# Altium project AMA4B_adapter_board.PrjPcb (part 2 of 2)

## Sheet P02_AMOLED.SchDoc
size A4; SheetNumber: 2; SheetTotal: 7
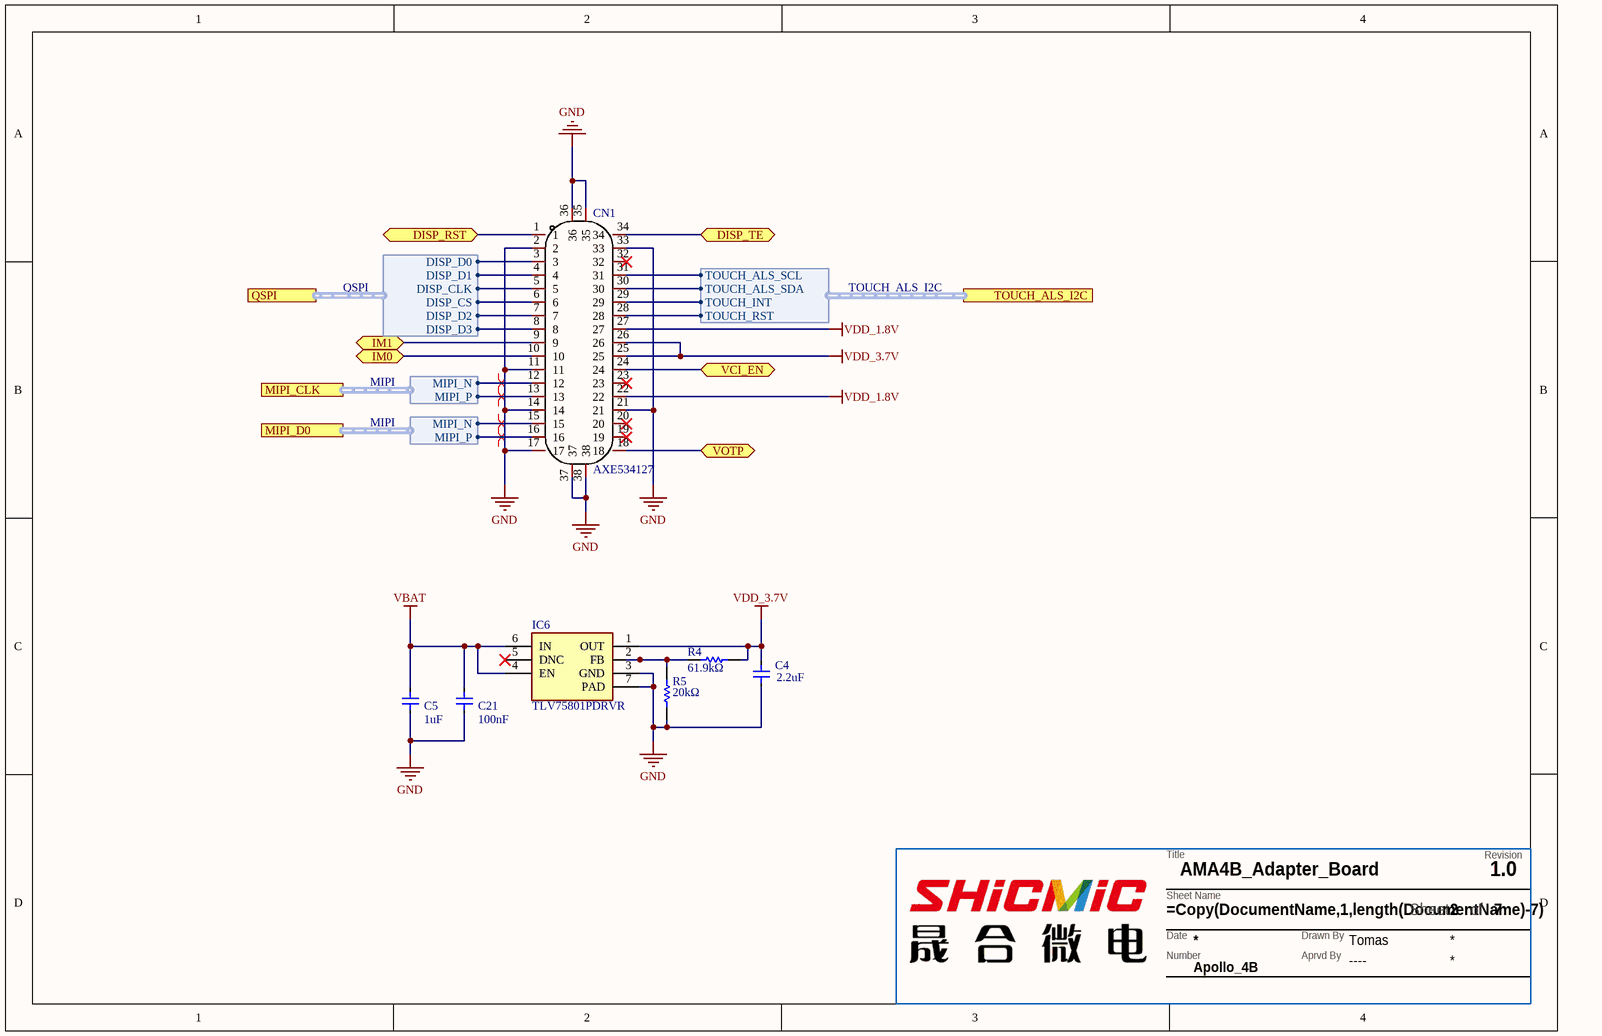
[diagram p6: P02_AMOLED.SchDoc]

### Parts
(Parts that share a designator on the sheet are numbered #1, #2 ... from top to bottom, then left to right.)
??#2  TitleBlock  (value not drawn)  (graphical)
C4  2.2uF  [CAP_0402]
C5  1uF  [CAP_0402]
C21  100nF  [CAP_0402]
CN1  AXE534127  [CONN-SMD_34P-P0.40_AXE534127]
IC6  TLV75801PDRVR  [SON65P200X200X80-7N]
R4  61.9kΩ  [RES_0402]
R5  20kΩ  [RES_0402]

### Ports
DISP_RST (bidir), DISP_TE (bidir), IM0 (bidir), IM1 (bidir), MIPI_CLK (harness MIPI), MIPI_D0 (harness MIPI), QSPI (harness QSPI), TOUCH_ALS_I2C (harness TOUCH_ALS_I2C), VCI_EN (bidir), VOTP (bidir)

### Harnesses
MIPI: MIPI_N, MIPI_P
QSPI: DISP_CLK, DISP_CS, DISP_D0, DISP_D1, DISP_D2, DISP_D3
TOUCH_ALS_I2C: TOUCH_ALS_SCL, TOUCH_ALS_SDA, TOUCH_INT, TOUCH_RST

### Nets
GND: C4.2 C5.2 C21.2 CN1.2 CN1.11 CN1.14 CN1.17 CN1.21 CN1.33 CN1.35 CN1.36 CN1.37 CN1.38 IC6.3(GND) IC6.7(PAD) R5.2
VBAT: C5.1 C21.1 IC6.4(EN) IC6.6(IN)
VDD_1.8V: CN1.22 CN1.27
VDD_3.7V: C4.1 CN1.25 CN1.26 IC6.1(OUT) R4.2
CTS01_GP59: CN1.9 ; port IM1
DISPCM_GP89: CN1.29 ; port TOUCH_ALS_I2C.TOUCH_INT
M0SCL_M0SCK_I2S0CK_RTS23_GP5: CN1.31 ; port TOUCH_ALS_I2C.TOUCH_ALS_SCL
M0SDA_M0MOSI_I2S0DAT_CTS01_I2S0DOUT_GP6: CN1.30 ; port TOUCH_ALS_I2C.TOUCH_ALS_SDA
M2MISO_DSPTCK_I2S0DIN_GP27: CN1.24 ; port VCI_EN
M2SDA_M2MOSI_DSPTCK_GP26: CN1.28 ; port TOUCH_ALS_I2C.TOUCH_RST
M3MISO_CKO_RX2_TE_GP33: CN1.34 ; port DISP_TE
MIPI_CLK.MIPI_N: CN1.12 ; port MIPI_CLK.MIPI_N
MIPI_CLK.MIPI_P: CN1.13 ; port MIPI_CLK.MIPI_P
MIPI_D0.MIPI_N: CN1.15 ; port MIPI_D0.MIPI_N
MIPI_D0.MIPI_P: CN1.16 ; port MIPI_D0.MIPI_P
MSPI00_32KXT_RTS0_DISPD0_I2S1DIN_GP64: CN1.3 ; port QSPI.DISP_D0
MSPI01_32KXT_CTS0_DISPD1_GP65: CN1.4 ; port QSPI.DISP_D1
MSPI02_CKO_TX0_DISPD2_GP66: CN1.7 ; port QSPI.DISP_D2
MSPI03_CKO_TX2_DISPD3_GP67: CN1.8 ; port QSPI.DISP_D3
MSPI08_CKO_SWTR2_TX0_DISPD8_GP72: CN1.5 ; port QSPI.DISP_CLK
PDM3DAT_SWO_RTS01_VCO_GP57: CN1.6 ; port QSPI.DISP_CS
RTS03_GP58: CN1.10 ; port IM0
TRIG0_VCO_I2S0DAT_CTS1_DSPTRSTN_I2S0DOUT_GP29: CN1.1 ; port DISP_RST
NetCN1_18: CN1.18 ; port VOTP
NetIC6_2: IC6.2(FB) R4.1 R5.1

Not connected (* = marked no-connect by the designer): CN1 19* 20* 23* 32*; IC6 5(DNC)*

### Layout directives
differential pair: MIPI_CLK.MIPI_N, MIPI_CLK.MIPI_P, MIPI_D0.MIPI_N, MIPI_D0.MIPI_P

### Notes on the sheet
- (in symbol TitleBlock) Revision; Title; Sheet Name; Sheet; of; Date; Drawn By; Number; Aprvd By

### Library data of the parts
??#2 = TitleBlock: Title block for Ambiq Schematics. Please have the following parameters entered in Project>Project Options>Parameters: / TBTitle / TBDocumentNumber / TBRevision / TBDrawnBy / TBApprovedBy; AMBIQ PN: TitleBlock
C4 = Capacitor: NONE; Manufacturer: Samsung; AMBIQ PN: CL05A225KP5NNNC; Tolerance: 10%; Voltage Rating: 10V; Supplier 1: Arrow Electronics; Supplier Part Number 1: CL05A225KP5NNNC; Manufacturer Part Number: CL05A225KP5NNNC; RoHS: Yes; Category: Ceramic Capacitors; Stock 1: 32414; Pricing 1: 1=0.14620, 10=0.09980, 25=0.09880, 100=0.05200, 250=0.05150, 500=0.03630, 1000=0.02990, 3000=0.02760, 6000=0.02610, 15000=0.023; Mount: Surface Mount; Case/Package: 0402; Case Code (Metric): 1005; Case Code (Imperial): 0402; Min Operating Temperature: -55°C; Max Operating Temperature: 85°C; Capacitance: 2.2uF; Packaging: Tape and Reel; Voltage Rating (DC): 10V; Series: CL; Length: 0.039inch; Width: 0.02inch; Thickness: 0.022inch; RoHS Compliant: Yes; ComponentLink1URL: https://datasheet.ciiva.com/25727/cl05a225kp5nnnc-25727777.pdf?src-supplier=Digi-Key; ComponentLink1Description: https://datasheet.ciiva.com/25727/cl05a225kp5nnnc-25727777.pdf?src-supplier=Digi-Key; Package Quantity: 1
C5 = Capacitor: NONE; Manufacturer: Samsung; Manufacturer Part Number: CL05A105MP5NNNC; AMBIQ PN: CL05A105KP5NNNC; Tolerance: 20%; Voltage Rating: 10V; Dielectric: X5R; Supplier 1: Newark; Supplier Part Number 1: 82AC9184; RoHS: Yes; Category: Ceramic Capacitors; Mount: Surface Mount; Case/Package: 0402; Case Code (Metric): 1005; Case Code (Imperial): 0402; Min Operating Temperature: -55°C; Max Operating Temperature: 85°C; Capacitance: 1uF; Packaging: Tape and Reel; Voltage Rating (DC): 10V; Series: CL; Construction: Flat; Length: 1mm; Width: 0.02inch; Height: 0.5mm; Thickness: 0.022inch; Depth: 0.5mm; Radiation Hardening: No; Lead Free: Lead Free; RoHS Compliant: Yes; ComponentLink1URL: https://datasheet.ciiva.com/25802/cl05a105mp5nnnc-25802049.pdf?src-supplier=Digi-Key; ComponentLink1Description: https://datasheet.ciiva.com/25802/cl05a105mp5nnnc-25802049.pdf?src-supplier=Digi-Key; Package Quantity: 1
C21 = Capacitor: NONE; Manufacturer: Kyocera AVX; AMBIQ PN: 0201ZD104KAT2A; Tolerance: 10%; Voltage Rating: 10V; Supplier 1: Arrow Electronics; Supplier Part Number 1: 0201ZD104KAT2A; Manufacturer Part Number: 0201ZD104KAT2A; RoHS: Yes; Category: Ceramic Capacitors; Stock 1: 105000; Pricing 1: 15000=0.00770, 30000=0.00750, 45000=0.00740, 60000=0.00720, 75000=0.00690, 150000=0.00620 (USD); Mount: Surface Mount; Case/Package: 0201; Case Code (Metric): 0603; Case Code (Imperial): 0201; Min Operating Temperature: -55°C; Max Operating Temperature: 85°C; Capacitance: 100nF; Packaging: Tape and Reel; Voltage Rating (DC): 10V; Series: -; Lead Free: Lead Free; RoHS Compliant: Yes; ComponentLink1URL: http://www.mouser.com/ds/2/40/cx5r-776519.pdf?src-supplier=Mouser; ComponentLink1Description: http://www.mouser.com/ds/2/40/cx5r-776519.pdf?src-supplier=Mouser
CN1 = AXE534127: Add into BOM: yes; Symbol: AXE534127; Device: AXE534127; LCSC Part Name: AXE534127; Supplier Part: C9900017244; Manufacturer Part: AXE534127; Supplier Footprint: SMD-34; JLCPCB Part Class: 扩展库; Datasheet: https://atta.szlcsc.comnull; Supplier: LCSC; Convert to PCB: yes; Name: AXE534127
IC6 = TLV75801PDRVR: Integrated Circuit; Manufacturer_Name: Texas Instruments; Datasheet Link: http://www.ti.com/lit/gpn/TLV758P; Height: 0.8mm; Manufacturer_Part_Number: TLV75801PDRVR; Mouser Part Number: 595-TLV75801PDRVR; Mouser Price/Stock: https://www.mouser.co.uk/ProductDetail/Texas-Instruments/TLV75801PDRVR?qs=PqoDHHvF64%2FZ6DyDKfEo8A%3D%3D; Arrow Part Number: TLV75801PDRVR; Arrow Price/Stock: https://www.arrow.com/en/products/tlv75801pdrvr/texas-instruments?region=europe
R4 = Resistor: Res Thick Film 0402 61.9K Ohm 1% 1/10W +/-100ppm/ßC Molded SMD Punched Carrier T/R; Manufacturer: Panasonic; AMBIQ PN: ERJ-2RKF6192X; Resistance: 61.9kR; Power Rating: 100mW; Voltage Rating: 50V; Temperature Coefficient: 100ppm/°C; Supplier 1: Arrow Electronics; Supplier Part Number 1: ERJ-2RKF6192X; Manufacturer Part Number: ERJ-2RKF6192X; RoHS: Yes; Category: Chip SMD Resistors; Stock 1: 50040; Pricing 1: 1=0.05180, 10=0.02920, 25=0.02020 (USD); Mount: Surface Mount; Case/Package: 0402; Case Code (Metric): 1005; Case Code (Imperial): 0402; Contact Plating: Tin; Min Operating Temperature: -55°C; Max Operating Temperature: 155°C; Package Quantity: 1; Packaging: Tape and Reel; Resistor Type: Thick Film; Number of Terminations: 2; Termination: SMD/SMT; Max Power Dissipation: 100mW; Voltage Rating (DC): 50V; Features: Automotive AEC-Q200; Series: ERJ; Construction: Rectangular; Length: 1mm; Width: 0.02inch; Height: 0.016inch; Depth: 0.5mm; REACH SVHC: No SVHC; Military Standard: Not; Lead Free: Lead Free; RoHS Compliant: Yes; ComponentLink1URL: https://datasheet.ciiva.com/31404/1678782-31404872.pdf?src-supplier=Farnell; ComponentLink1Description: https://datasheet.ciiva.com/31404/1678782-31404872.pdf?src-supplier=Farnell; ComponentLink2URL: https://datasheet.ciiva.com/6201/426256-6201383.pdf?src-supplier=Farnell; ComponentLink2Description: https://datasheet.ciiva.com/6201/426256-6201383.pdf?src-supplier=Farnell; ComponentLink3URL: https://datasheet.ciiva.com/43460/426256-43460335.pdf?src-supplier=Farnell; Tolerance: 1%; Resistance Tolerance: 1%
R5 = Resistor: Res Thick Film 0402 20K Ohm 1% 1/16W ±100ppm/°C Molded SMD Paper T/R; Manufacturer: Vishay; AMBIQ PN: CRCW040220K0FKED; Resistance: 20kR; Power Rating: 63mW; Voltage Rating: 50V; Supplier 1: Newark; Supplier Part Number 1: 24W2083; Manufacturer Part Number: CRCW040220K0FKED; RoHS: Yes; Category: Chip SMD Resistors; Stock 1: 380000; Pricing 1: 1=0.00600, 10000=0.00600 (USD); Mount: Surface Mount; Case/Package: 0402; Weight: 2.3E-05oz; Case Code (Metric): 1005; Case Code (Imperial): 0402; Contact Plating: Tin; Min Operating Temperature: -55°C; Max Operating Temperature: 155°C; Package Quantity: 10; Packaging: Tape and Reel; Resistor Type: Thick Film; Number of Terminations: 2; Termination: SMD/SMT; Max Power Dissipation: 63mW; Temperature Coefficient: 100ppm/°C; Voltage Rating (DC): 50V; Features: Automotive AEC-Q200; Series: CRCW; Technology: THICK FILM; Construction: Rectangular; Length: 1mm; Width: 0.5mm; Height: 0.35mm; Depth: 0.5mm; Radiation Hardening: No; REACH SVHC: Unknown; Military Standard: Not; Lead Free: Lead Free; RoHS Compliant: Yes; ComponentLink1URL: https://datasheet.ciiva.com/11810/0900766b80d98824-11810023.pdf?src-supplier=RSComponents; ComponentLink1Description: https://datasheet.ciiva.com/11810/0900766b80d98824-11810023.pdf?src-supplier=RSComponents; ComponentLink2URL: https://datasheet.ciiva.com/2463/dcrcwe3-2463139.pdf?src-supplier=Digi-Key; ComponentLink2Description: https://datasheet.ciiva.com/2463/dcrcwe3-2463139.pdf?src-supplier=Digi-Key; ComponentLink3URL: https://datasheet.ciiva.com/2463/dcrcwe3-2463140.pdf?src-supplier=Digi-Key; Tolerance: 1%; Number of Pins: 2; Resistance Tolerance: 1%; Working Voltage: 50V

## Sheet P07_Peripheral.SchDoc
size A4; SheetNumber: 7; SheetTotal: 7
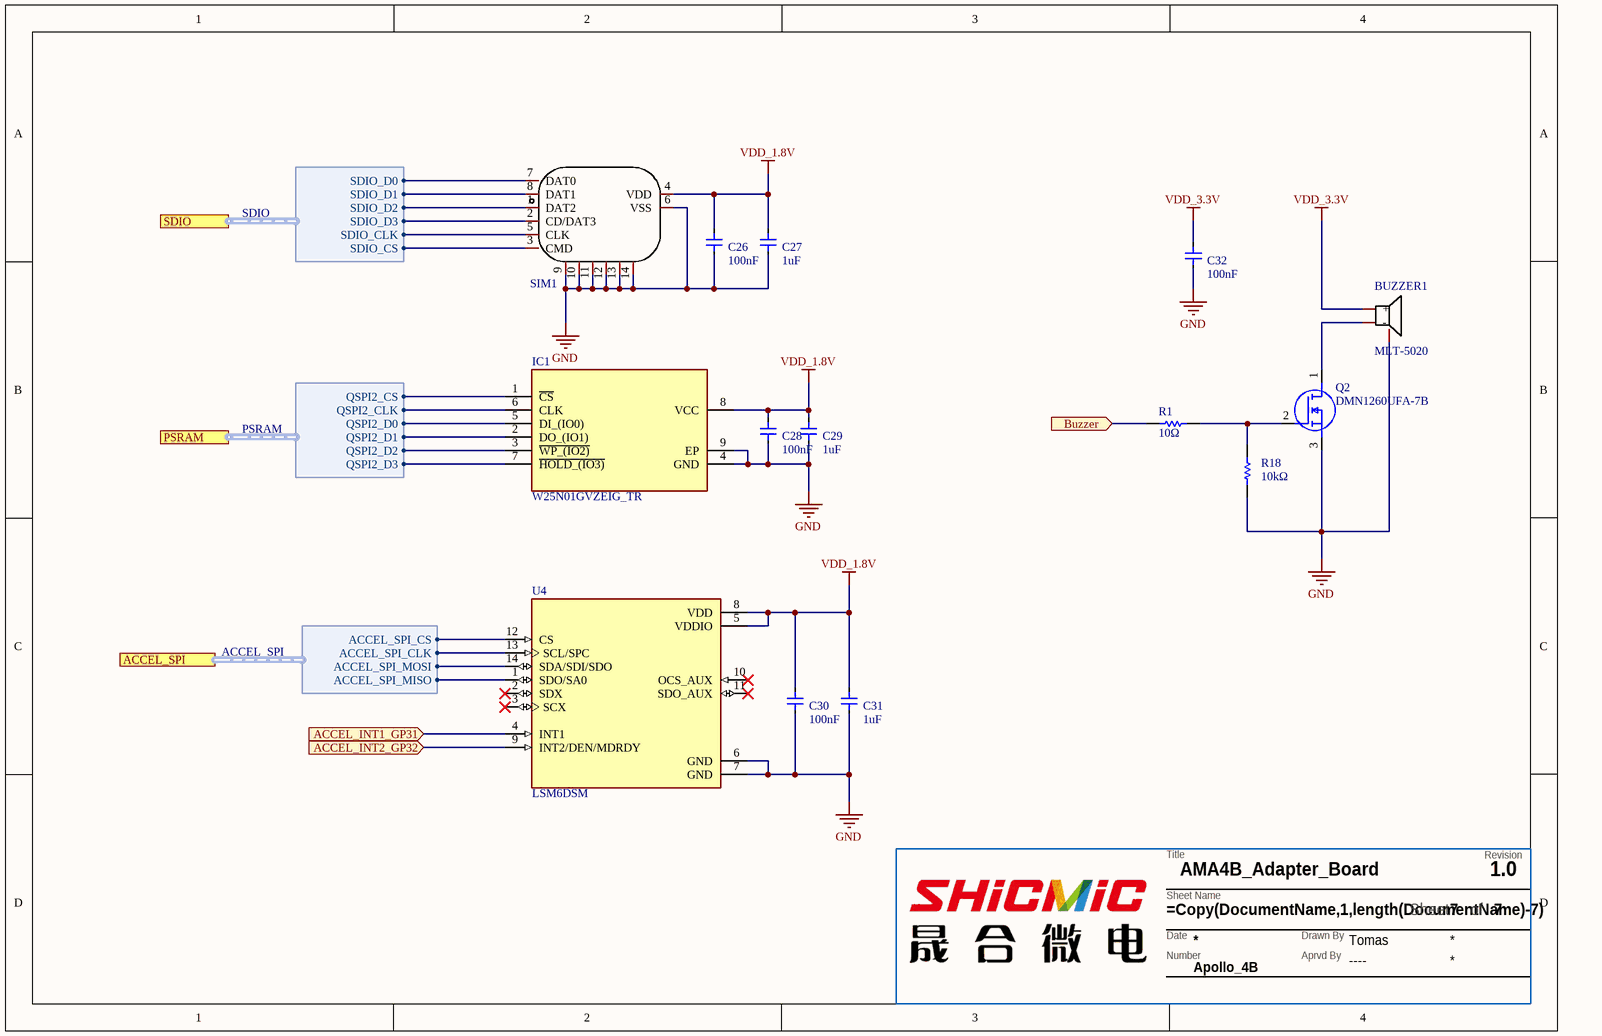
[diagram p7: P07_Peripheral.SchDoc]

### Parts
(Parts that share a designator on the sheet are numbered #1, #2 ... from top to bottom, then left to right.)
??#3  TitleBlock  (value not drawn)  (graphical)
BUZZER1  4000Hz  [BUZ-SMD_L5.0-W5.5-P4.60]  (value not drawn)
C26  100nF  [CAP_0402]
C27  1uF  [CAP_0402]
C28  100nF  [CAP_0402]
C29  1uF  [CAP_0402]
C30  100nF  [CAP_0402]
C31  1uF  [CAP_0402]
C32  100nF  [CAP_0402]
IC1  W25N01GVZEIG_TR  [SON127P800X600X80-9N-D]
Q2  DMN1260UFA-7B  [DMN1260UFA7B]
R1  10Ω  [RES_0402]
R18  10kΩ  [RES_0402]
SIM1  1040310811  [SIM-SMD_8P-1040310811]  (value not drawn)
U4  LSM6DSM  [PQFN50P300X250X86-14N]

### Ports
ACCEL_INT1_GP31 (in), ACCEL_INT2_GP32 (in), ACCEL_SPI (harness ACCEL_SPI), Buzzer (in), PSRAM (harness PSRAM), SDIO (harness SDIO)

### Harnesses
ACCEL_SPI: ACCEL_SPI_CLK, ACCEL_SPI_CS, ACCEL_SPI_MISO, ACCEL_SPI_MOSI
PSRAM: QSPI2_CLK, QSPI2_CS, QSPI2_D0, QSPI2_D1, QSPI2_D2, QSPI2_D3
SDIO: SDIO_CLK, SDIO_CS, SDIO_D0, SDIO_D1, SDIO_D2, SDIO_D3

### Nets
GND: BUZZER1.3(NC) C26.2 C27.2 C28.2 C29.2 C30.2 C31.2 C32.2 IC1.4(GND) IC1.9(EP) Q2.3(S) R18.1 SIM1.6(VSS) SIM1.9 SIM1.10 SIM1.11 SIM1.12 SIM1.13 SIM1.14 U4.6(GND) U4.7(GND)
VDD_1.8V: C26.1 C27.1 C28.1 C29.1 C30.1 C31.1 IC1.8(VCC) SIM1.4(VDD) U4.5(VDDIO) U4.8(VDD)
VDD_3.3V: BUZZER1.1(+) C32.1
CMIN1_I2S0CK_RX23_GP11: U4.12(CS) ; port ACCEL_SPI.ACCEL_SPI_CS
M2SCL_M2SCK_DSPTMS_GP25: IC1.1(~{CS}) ; port PSRAM.QSPI2_CS
M3SCL_M3SCK_TX2_GP31: U4.4(INT1) ; port ACCEL_INT1_GP31
M3SDA_M3MOSI_RX0_GP32: U4.9(INT2/DEN/MDRDY) ; port ACCEL_INT2_GP32
M7MISO_SWO_RTS01_GP24: U4.1(SDO/SA0) ; port ACCEL_SPI.ACCEL_SPI_MISO
M7SCL_M7SCK_SWO_RX01_GP22: U4.13(SCL/SPC) ; port ACCEL_SPI.ACCEL_SPI_CLK
M7SDA_M7MOSI_SWO_RX23_GP23: U4.14(SDA/SDI/SDO) ; port ACCEL_SPI.ACCEL_SPI_MOSI
MSPI20_QSPID0_RX0_DISPD10_DSPISD_GP74: IC1.5(DI_(IO0)) ; port PSRAM.QSPI2_D0
MSPI21_QSPID1_RX2_DISPD11_DSPIDCX_GP75: IC1.2(DO_(IO1)) ; port PSRAM.QSPI2_D1
MSPI22_QSPID2_RTS0_DISPD12_GP76: IC1.3(~{WP_(IO2)}) ; port PSRAM.QSPI2_D2
MSPI23_QSPID3_CTS0_DISPD13_GP77: IC1.7(~{HOLD_(IO3)}) ; port PSRAM.QSPI2_D3
MSPI24_QSPISCK_DISPD14_DSPISCK_GP78: IC1.6(CLK) ; port PSRAM.QSPI2_CLK
MSPI29_32KXT_SDIFCMD_SWTR3_DISPSD_GP83: SIM1.3(CMD) ; port SDIO.SDIO_CS
SDIFCK0_GP88: SIM1.5(CLK) ; port SDIO.SDIO_CLK
SDIFD0_GP84: SIM1.7(DAT0) ; port SDIO.SDIO_D0
SDIFD1_GP85: SIM1.8(DAT1) ; port SDIO.SDIO_D1
SDIFD2_GP86: SIM1.1(DAT2) ; port SDIO.SDIO_D2
SDIFD3_TE_GP87: SIM1.2(CD/DAT3) ; port SDIO.SDIO_D3
VCO_GP90: R1.2 ; port Buzzer
NetBUZZER1_2: BUZZER1.2(-) Q2.1(D)
NetQ2_2: Q2.2(G) R1.1 R18.2

Not connected (* = marked no-connect by the designer): U4 2(SDX)* 3(SCX)* 10(OCS_AUX)* 11(SDO_AUX)*

### Notes on the sheet
- (in symbol TitleBlock) Revision; Title; Sheet Name; Sheet; of; Date; Drawn By; Number; Aprvd By

### Library data of the parts
??#3 = TitleBlock: as ??#2 on sheet P02_AMOLED; AMBIQ PN: TitleBlock
BUZZER1 = MLT-5020: Manufacturer: 华能; Add into BOM: yes; Oscillator Circuit: 无源(外部驱动); Technology Type: 电磁式; Name: 4000Hz; Symbol: MLT-5020; LCSC Part Name: MLT-5020; Supplier Part: C94598; Manufacturer Part: MLT-5020; Supplier Footprint: SMD,5x5mm; JLCPCB Part Class: 扩展库; Datasheet: https://atta.szlcsc.com/upload/public/pdf/source/20210811/111454390007D221D7259018FB170E62.pdf; Supplier: LCSC; Convert to PCB: yes; Value: 4000Hz; Length: 5.2mm; Width: 5.2mm; Height: 2.5mm; Device: MLT-5020
C26 C28 C30 C32 = Capacitor: as C21 on sheet P02_AMOLED; Supplier 1: Arrow Electronics; Supplier Part Number 1: 0201ZD104KAT2A; Manufacturer Part Number: 0201ZD104KAT2A; RoHS: Yes; Category: Ceramic Capacitors; Stock 1: 105000; Pricing 1: 15000=0.00770, 30000=0.00750, 45000=0.00740, 60000=0.00720, 75000=0.00690, 150000=0.00620 (USD); Mount: Surface Mount; Case/Package: 0201; Case Code (Metric): 0603; Case Code (Imperial): 0201; Min Operating Temperature: -55°C; Max Operating Temperature: 85°C; Capacitance: 100nF; Packaging: Tape and Reel; Voltage Rating (DC): 10V; Series: -; Lead Free: Lead Free; RoHS Compliant: Yes; ComponentLink1URL: http://www.mouser.com/ds/2/40/cx5r-776519.pdf?src-supplier=Mouser; ComponentLink1Description: http://www.mouser.com/ds/2/40/cx5r-776519.pdf?src-supplier=Mouser
C27 C29 C31 = Capacitor: as C5 on sheet P02_AMOLED; Supplier 1: Newark; Supplier Part Number 1: 82AC9184; RoHS: Yes; Category: Ceramic Capacitors; Mount: Surface Mount; Case/Package: 0402; Case Code (Metric): 1005; Case Code (Imperial): 0402; Min Operating Temperature: -55°C; Max Operating Temperature: 85°C; Capacitance: 1uF; Packaging: Tape and Reel; Voltage Rating (DC): 10V; Series: CL; Construction: Flat; Length: 1mm; Width: 0.02inch; Height: 0.5mm; Thickness: 0.022inch; Depth: 0.5mm; Radiation Hardening: No; Lead Free: Lead Free; RoHS Compliant: Yes; ComponentLink1URL: https://datasheet.ciiva.com/25802/cl05a105mp5nnnc-25802049.pdf?src-supplier=Digi-Key; ComponentLink1Description: https://datasheet.ciiva.com/25802/cl05a105mp5nnnc-25802049.pdf?src-supplier=Digi-Key; Package Quantity: 1
IC1 = W25N01GVZEIG_TR: Integrated Circuit; Manufacturer_Name: Winbond; Manufacturer_Part_Number: W25N01GVZEIG TR; Datasheet Link: https://www.winbond.com/resource-files/w25n01gv revg 032116.pdf; Height: 0.8mm; Mouser Part Number: 454-W25N01GVZEIGTR; Mouser Price/Stock: https://www.mouser.co.uk/ProductDetail/Winbond/W25N01GVZEIG-TR?qs=qSfuJ%252Bfl%2Fd6niBi0Qz1MPg%3D%3D; Arrow Part Number: W25N01GVZEIG TR; Arrow Price/Stock: https://www.arrow.com/en/products/w25n01gvzeigtr/winbond-electronics?region=nac
Q2 = DMN1260UFA-7B: MOSFET (N-Channel); Manufacturer_Name: Diodes Incorporated; Datasheet Link: https://www.diodes.com/assets/Datasheets/DMN1260UFA.pdf; Height: 0.4mm; Manufacturer_Part_Number: DMN1260UFA-7B; Mouser Part Number: 621-DMN1260UFA-7B; Mouser Price/Stock: https://www.mouser.co.uk/ProductDetail/Diodes-Incorporated/DMN1260UFA-7B?qs=TL2rE588Q1GjQdkyrZCA4w%3D%3D; Arrow Part Number: DMN1260UFA-7B; Arrow Price/Stock: https://www.arrow.com/en/products/dmn1260ufa-7b/diodes-incorporated
R1 R18 = Resistor: Surface Mount Thick Film Resistor, Rc Series, 10 Kohm, 62.5 Mw, - 1%, 50 V, 0402 [1005 Metric]; Manufacturer: Yageo; AMBIQ PN: RC0402FR-0710KL; Resistance: 10kR; Power Rating: 62.5mW; Voltage Rating: 50V; Max Power Dissipation: 63mW; Temperature Coefficient: 100ppm/°C; Supplier 1: Arrow Electronics; Supplier Part Number 1: RC0402FR-0710KL; Manufacturer Part Number: RC0402FR-0710KL; RoHS: Yes; Category: Chip SMD Resistors; Stock 1: 7776428; Pricing 1: 10000=0.00210 (USD); Case/Package: 0402; Case Code (Metric): 1005; Case Code (Imperial): 0402; Min Operating Temperature: -55°C; Max Operating Temperature: 155°C; Packaging: Tape and Reel; Resistor Type: Thick Film; Number of Terminations: 2; Termination: SMD/SMT; Voltage Rating (DC): 50V; Features: Moisture Resistant; Series: RC; Construction: Rectangular; Length: 1mm; Width: 0.5mm; Height: 0.32mm; Depth: 0.5mm; REACH SVHC: No SVHC; Military Standard: Not; Lead Free: Lead Free; RoHS Compliant: Yes; ComponentLink1URL: https://datasheet.ciiva.com/7660/38568-7660787.pdf?src-supplier=Element14; ComponentLink1Description: https://datasheet.ciiva.com/7660/38568-7660787.pdf?src-supplier=Element14; ComponentLink2URL: https://datasheet.ciiva.com/7849/1686128-7849814.pdf?src-supplier=Element14; ComponentLink2Description: https://datasheet.ciiva.com/7849/1686128-7849814.pdf?src-supplier=Element14; ComponentLink3URL: https://datasheet.ciiva.com/7983/1018594-7983486.pdf?src-supplier=Element14; Tolerance: 1%; Number of Pins: 2; Resistance Tolerance: 1%; Working Voltage: 50V; Lead Pitch: 0.2mm
SIM1 = 1040310811: Manufacturer: MOLEX; Add into BOM: yes; Card Connection Mode: 拔插式; Card Type: MicroSD卡(TF卡); Connector Type: 卡座; Maximum Body Height: 1.42mm; Name: 1040310811; Symbol: 1040310811; Device: 1040310811; LCSC Part Name: 拔插式 MicroSD卡(TF卡) 卡座; Supplier Part: C585350; Manufacturer Part: 1040310811; Supplier Footprint: SMD; JLCPCB Part Class: 扩展库; Datasheet: https://atta.szlcsc.com/upload/public/pdf/source/20201117/C585350_D1F0B30BD23514449186B2E50ACE8BBF.pdf; Supplier: LCSC; Convert to PCB: yes; Operating Temperature Range: -
U4 = LSM6DSM: Accelerometer, Gyroscope, Temperature, 6 Axis Sensor IÂ²C, SPI Output; MF: STMicroelectronics; Availability: In Stock; Purchase-URL: https://pricing.snapeda.com/search/part/LSM6DSM/?ref=eda; Package: VFLGA-14 STMicroelectronics; MP: LSM6DSM; Value: *; Check_prices: https://www.snapeda.com/parts/LSM6DSM/STMicroelectronics/view-part/?ref=eda; SnapEDA_Link: https://www.snapeda.com/parts/LSM6DSM/STMicroelectronics/view-part/?ref=snap; Price: None

## Nets that join several sheets
GND: P06_Apollo4B_Core (12 pins), P03_ Power Supplies (41 pins), P04_ USB (TP4.TP U8.1), P05_ Debugger (R27.1 TP14.TP), P02_AMOLED (16 pins), P07_Peripheral (21 pins)
VBAT: P03_ Power Supplies (14 pins), P02_AMOLED (C5.1 C21.1 IC6.4 IC6.6)
VBUS_5V: P03_ Power Supplies (5 pins), P04_ USB (FB1.2)
VDD18: P06_Apollo4B_Core (U1.33), P03_ Power Supplies (C13.1 IC5.A1)
VDD_1.8V: P06_Apollo4B_Core (U1.10 U1.59 U1.88 U1.105), P03_ Power Supplies (7 pins), P05_ Debugger (R26.2 TP13.TP), P02_AMOLED (CN1.22 CN1.27), P07_Peripheral (10 pins)
VDD_3.3V: P03_ Power Supplies (10 pins), P07_Peripheral (BUZZER1.1 C32.1)
VDDUSB0P9: P06_Apollo4B_Core (U1.12), P03_ Power Supplies (C18.1 U7.8 U7.9)
VDDUSB33: P06_Apollo4B_Core (U1.11), P03_ Power Supplies (C19.1 U7.13 U7.14)
ADC3_I2S1CK_RTS1_GP16: P06_Apollo4B_Core (U1.70), P03_ Power Supplies (R13.1 R14.2 U7.5)
ADC5_RX1_I2S0DIN_GP14: P06_Apollo4B_Core (U1.72), P03_ Power Supplies (IC5.B2 R11.1 R12.2)
ADC6_I2S0WS_TX23_GP13: P06_Apollo4B_Core (U1.74), P03_ Power Supplies (R9.1 R10.2 U7.3)
ADC7_I2S0DAT_TX01_CMRF2_I2S0DOUT_GP12: P06_Apollo4B_Core (U1.81), P05_ Debugger (TP10.TP)
AP_USB.USB_N: P06_Apollo4B_Core (U1.8), P04_ USB (TP3.TP U8.2)
AP_USB.USB_P: P06_Apollo4B_Core (U1.6), P04_ USB (TP2.TP U8.3)
CMIN1_I2S0CK_RX23_GP11: P06_Apollo4B_Core (U1.97), P07_Peripheral (U4.12)
CTS01_GP59: P06_Apollo4B_Core (U1.50), P02_AMOLED (CN1.9)
DISPCM_GP89: P06_Apollo4B_Core (U1.44), P02_AMOLED (CN1.29)
M0SCL_M0SCK_I2S0CK_RTS23_GP5: P06_Apollo4B_Core (U1.102), P02_AMOLED (CN1.31)
M0SDA_M0MOSI_I2S0DAT_CTS01_I2S0DOUT_GP6: P06_Apollo4B_Core (U1.47), P02_AMOLED (CN1.30)
M2MISO_DSPTCK_I2S0DIN_GP27: P06_Apollo4B_Core (U1.4), P02_AMOLED (CN1.24)
M2SCL_M2SCK_DSPTMS_GP25: P06_Apollo4B_Core (U1.37), P07_Peripheral (IC1.1)
M2SDA_M2MOSI_DSPTCK_GP26: P06_Apollo4B_Core (U1.1), P02_AMOLED (CN1.28)
M3MISO_CKO_RX2_TE_GP33: P06_Apollo4B_Core (U1.86), P02_AMOLED (CN1.34)
M3SCL_M3SCK_TX2_GP31: P06_Apollo4B_Core (U1.94), P07_Peripheral (U4.4)
M3SDA_M3MOSI_RX0_GP32: P06_Apollo4B_Core (U1.93), P07_Peripheral (U4.9)
M5MISO_I2S1WS_RTS01_GP49: P06_Apollo4B_Core (U1.99), P05_ Debugger (TP12.TP)
M5SCL_M5SCK_I2S1CK_RX01_GP47: P06_Apollo4B_Core (U1.103), P05_ Debugger (TP9.TP)
M7MISO_SWO_RTS01_GP24: P06_Apollo4B_Core (U1.91), P07_Peripheral (U4.1)
M7SCL_M7SCK_SWO_RX01_GP22: P06_Apollo4B_Core (U1.85), P07_Peripheral (U4.13)
M7SDA_M7MOSI_SWO_RX23_GP23: P06_Apollo4B_Core (U1.92), P07_Peripheral (U4.14)
MIPI_CLK.MIPI_N: P06_Apollo4B_Core (U1.22), P02_AMOLED (CN1.12)
MIPI_CLK.MIPI_P: P06_Apollo4B_Core (U1.20), P02_AMOLED (CN1.13)
MIPI_D0.MIPI_N: P06_Apollo4B_Core (U1.18), P02_AMOLED (CN1.15)
MIPI_D0.MIPI_P: P06_Apollo4B_Core (U1.16), P02_AMOLED (CN1.16)
MSPI00_32KXT_RTS0_DISPD0_I2S1DIN_GP64: P06_Apollo4B_Core (U1.80), P02_AMOLED (CN1.3)
MSPI01_32KXT_CTS0_DISPD1_GP65: P06_Apollo4B_Core (U1.60), P02_AMOLED (CN1.4)
MSPI02_CKO_TX0_DISPD2_GP66: P06_Apollo4B_Core (U1.61), P02_AMOLED (CN1.7)
MSPI03_CKO_TX2_DISPD3_GP67: P06_Apollo4B_Core (U1.73), P02_AMOLED (CN1.8)
MSPI08_CKO_SWTR2_TX0_DISPD8_GP72: P06_Apollo4B_Core (U1.69), P02_AMOLED (CN1.5)
MSPI20_QSPID0_RX0_DISPD10_DSPISD_GP74: P06_Apollo4B_Core (U1.31), P07_Peripheral (IC1.5)
MSPI21_QSPID1_RX2_DISPD11_DSPIDCX_GP75: P06_Apollo4B_Core (U1.30), P07_Peripheral (IC1.2)
MSPI22_QSPID2_RTS0_DISPD12_GP76: P06_Apollo4B_Core (U1.29), P07_Peripheral (IC1.3)
MSPI23_QSPID3_CTS0_DISPD13_GP77: P06_Apollo4B_Core (U1.28), P07_Peripheral (IC1.7)
MSPI24_QSPISCK_DISPD14_DSPISCK_GP78: P06_Apollo4B_Core (U1.26), P07_Peripheral (IC1.6)
MSPI29_32KXT_SDIFCMD_SWTR3_DISPSD_GP83: P06_Apollo4B_Core (U1.41), P07_Peripheral (SIM1.3)
nRST: P06_Apollo4B_Core (U1.62), P05_ Debugger (TP8.TP)
PDM3DAT_SWO_RTS01_VCO_GP57: P06_Apollo4B_Core (U1.55), P02_AMOLED (CN1.6)
RTS03_GP58: P06_Apollo4B_Core (U1.49), P02_AMOLED (CN1.10)
SDIFCK0_GP88: P06_Apollo4B_Core (U1.54), P07_Peripheral (SIM1.5)
SDIFD0_GP84: P06_Apollo4B_Core (U1.51), P07_Peripheral (SIM1.7)
SDIFD1_GP85: P06_Apollo4B_Core (U1.52), P07_Peripheral (SIM1.8)
SDIFD2_GP86: P06_Apollo4B_Core (U1.43), P07_Peripheral (SIM1.1)
SDIFD3_TE_GP87: P06_Apollo4B_Core (U1.53), P07_Peripheral (SIM1.2)
SWDCK_TX01_GP20: P06_Apollo4B_Core (U1.90), P05_ Debugger (R27.2 TP6.TP)
SWDIO_TX23_GP21: P06_Apollo4B_Core (U1.89), P05_ Debugger (R26.1 TP5.TP)
SWO_VCO_IS20CK_DSPTDO_GP28: P06_Apollo4B_Core (U1.84), P05_ Debugger (TP7.TP)
TRIG0_VCO_I2S0DAT_CTS1_DSPTRSTN_I2S0DOUT_GP29: P06_Apollo4B_Core (U1.98), P02_AMOLED (CN1.1)
VCO_GP90: P06_Apollo4B_Core (U1.95), P07_Peripheral (R1.2)
VCO_GP91: P06_Apollo4B_Core (U1.96), P03_ Power Supplies (R16.2)

## Assembly variants
AMAP4BPXEVB: all parts fitted